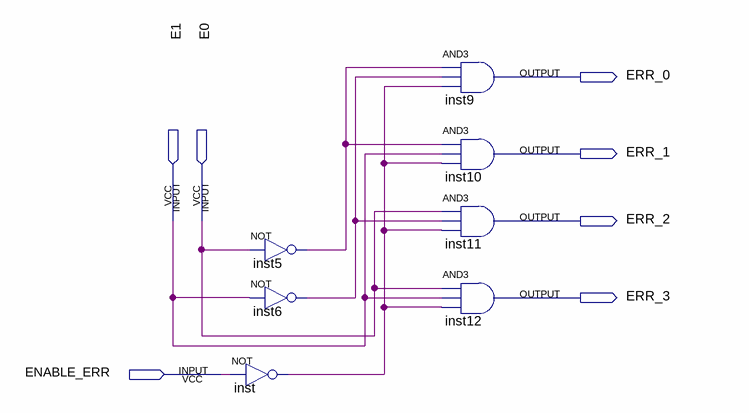
[diagram p0: schematic sheet]
// Quartus schematic generate_error.bdf as structural Verilog: 7 symbols, 7 pins
module generate_error (
  input  E1,
  input  E0,
  input  ENABLE_ERR,
  output ERR_0,
  output ERR_1,
  output ERR_2,
  output ERR_3
);

  wire inst5_out, inst6_out, inst_out;

  not inst5 (inst5_out, E0);
  not inst6 (inst6_out, E1);
  not inst (inst_out, ENABLE_ERR);
  and inst9 (ERR_0, inst5_out, inst6_out, inst_out);
  and inst10 (ERR_1, inst5_out, E1, inst_out);
  and inst11 (ERR_2, E0, inst6_out, inst_out);
  and inst12 (ERR_3, E0, E1, inst_out);
endmodule
